# EAGLE design WheelPCB (EAGLE 9.6.2)
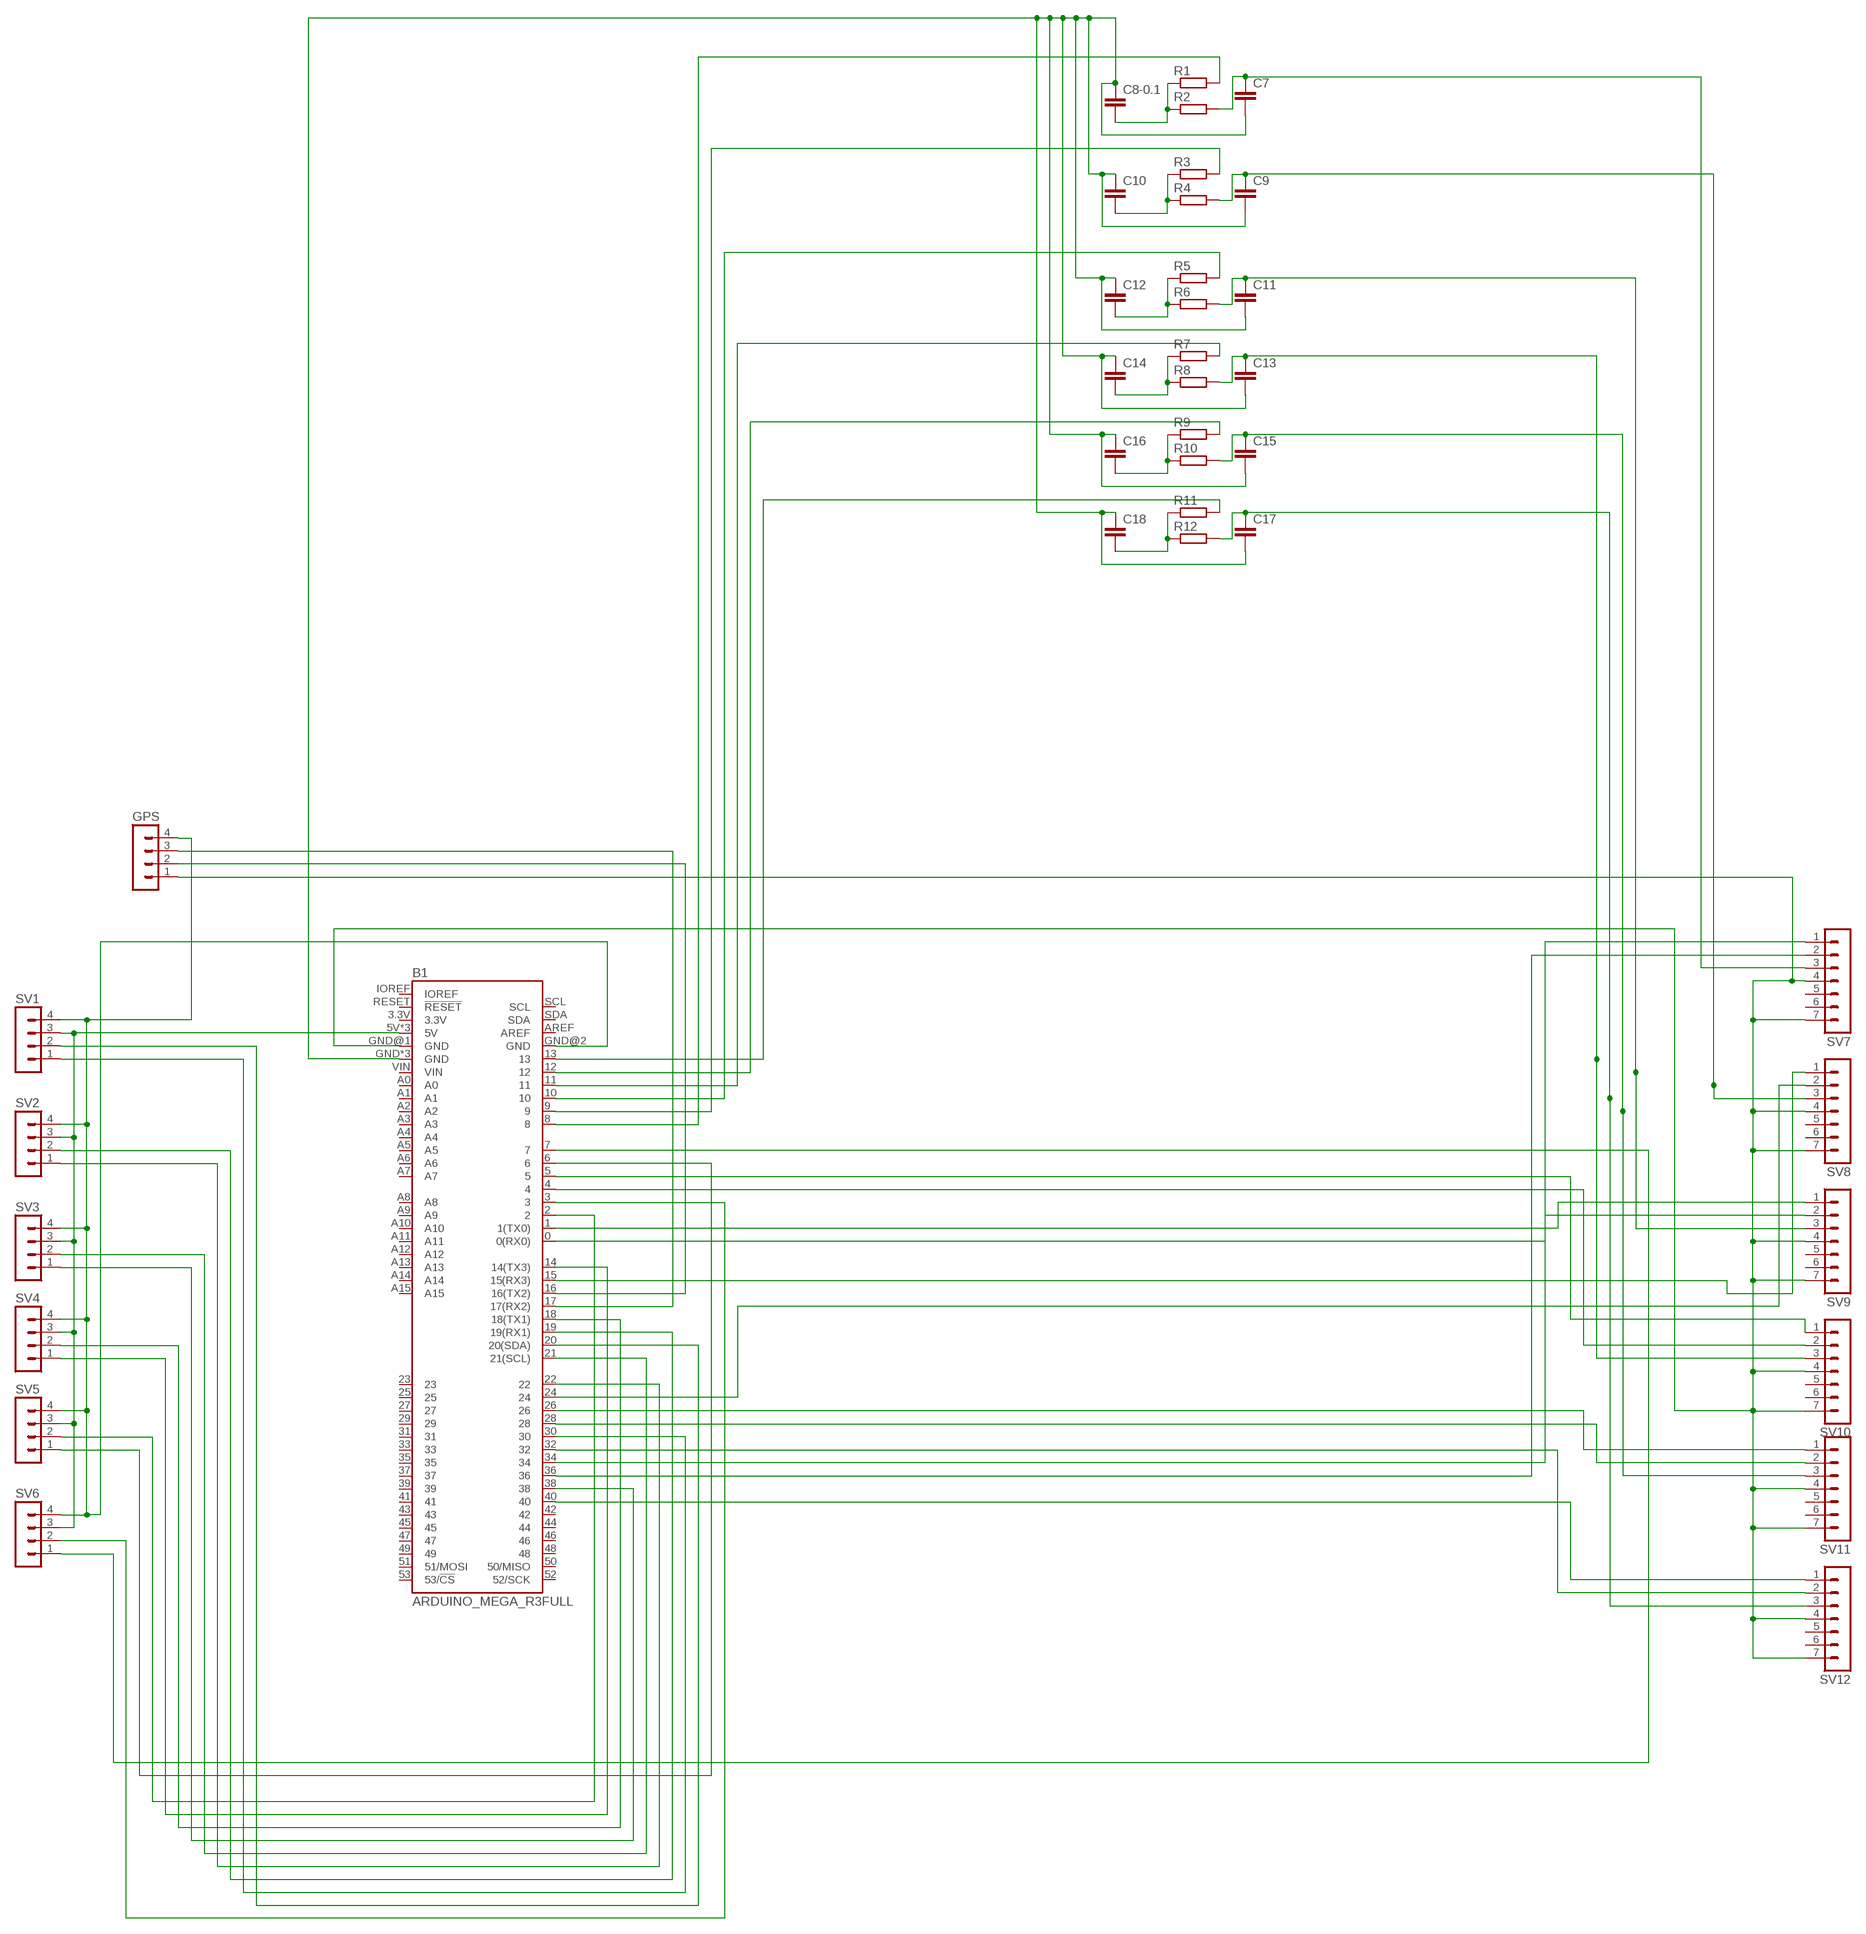
[diagram p0: schematic, sheet 1]

## Parts
B1  ARDUINO_MEGA_R3FULL  [ARDUINO_MEGA_NO_SILK]
C7  C2.5/5  [C2.5-5]
C8-0.1  C2.5/5  [C2.5-5]
C9  C2.5/5  [C2.5-5]
C10  C2.5/5  [C2.5-5]
C11  C2.5/5  [C2.5-5]
C12  C2.5/5  [C2.5-5]
C13  C2.5/5  [C2.5-5]
C14  C2.5/5  [C2.5-5]
C15  C2.5/5  [C2.5-5]
C16  C2.5/5  [C2.5-5]
C17  C2.5/5  [C2.5-5]
C18  C2.5/5  [C2.5-5]
GPS  MA04-1  [MA04-1]
R1  R-EU_0207/10  [0207/10]
R2  R-EU_0207/10  [0207/10]
R3  R-EU_0207/10  [0207/10]
R4  R-EU_0207/10  [0207/10]
R5  R-EU_0207/10  [0207/10]
R6  R-EU_0207/10  [0207/10]
R7  R-EU_0207/10  [0207/10]
R8  R-EU_0207/10  [0207/10]
R9  R-EU_0207/10  [0207/10]
R10  R-EU_0207/10  [0207/10]
R11  R-EU_0207/10  [0207/10]
R12  R-EU_0207/10  [0207/10]
SV1  MA04-1  [MA04-1]
SV2  MA04-1  [MA04-1]
SV3  MA04-1  [MA04-1]
SV4  MA04-1  [MA04-1]
SV5  MA04-1  [MA04-1]
SV6  MA04-1  [MA04-1]
SV7  MA07-1  [MA07-1]
SV8  MA07-1  [MA07-1]
SV9  MA07-1  [MA07-1]
SV10  MA07-1  [MA07-1]
SV11  MA07-1  [MA07-1]
SV12  MA07-1  [MA07-1]

## Nets
N$1: B1.GND@1(GND) GPS.1 SV7.4 SV7.7 SV8.4 SV8.7 SV9.4 SV9.7 SV10.4 SV10.7 SV11.4 SV11.7 SV12.4 SV12.7
N$2: C13.1 R8.2 SV10.3
N$3: B1.13 R11.2
N$4: C15.1 R10.2 SV11.3
N$5: C11.1 R6.2 SV9.3
N$6: C9.1 R4.2 SV8.3
N$7: C17.1 R12.2 SV12.3
N$8: B1.4 SV10.2
N$9: B1.5 SV10.1
N$10: B1.7 SV6.1
N$11: B1.6 SV5.1
N$12: B1.3 SV6.2
N$13: B1.2 SV5.2
N$14: B1.1(1(TX0)) SV9.1
N$15: B1.0(0(RX0)) SV9.2
N$16: B1.15(15(RX3)) SV8.1
N$17: B1.24 SV8.2
N$18: B1.40 SV12.1
N$19: B1.32 SV12.2
N$20: B1.26 SV11.1
N$21: B1.28 SV11.2
N$22: B1.34 SV7.1
N$23: B1.36 SV7.2
N$24: B1.14(14(TX3)) SV4.1
N$25: B1.18(18(TX1)) SV4.2
N$26: B1.38 SV3.1
N$27: B1.21(21(SCL)) SV3.2
N$28: B1.22 SV2.1
N$29: B1.19(19(RX1)) SV2.2
N$30: B1.30 SV1.1
N$31: B1.20(20(SDA)) SV1.2
N$32: B1.5V B1.5V@1(5V) B1.5V@2(5V) SV1.3 SV2.3 SV3.3 SV4.3 SV5.3 SV6.3
N$33: B1.GND@2(GND) GPS.4 SV1.4 SV2.4 SV3.4 SV4.4 SV5.4 SV6.4
N$34: B1.16(16(TX2)) GPS.2
N$35: B1.17(17(RX2)) GPS.3
N$36: B1.8 R1.2
N$37: C8-0.1.2 R1.1 R2.1
N$38: B1.10 R5.2
N$39: C7.1 R2.2 SV7.3
N$40: C10.2 R3.1 R4.1
N$42: B1.9 R3.2
N$43: C12.2 R5.1 R6.1
N$45: C14.2 R7.1 R8.1
N$46: B1.11 R7.2
N$47: C18.2 R11.1 R12.1
N$50: B1.12 R9.2
N$52: C16.2 R9.1 R10.1
N$53: B1.GND B1.GND@3(GND) B1.GND@4(GND) C7.2 C8-0.1.1 C9.2 C10.1 C11.2 C12.1 C13.2 C14.1 C15.2 C16.1 C17.2 C18.1
Unconnected: B1.3.3V B1.23 B1.25 B1.27 B1.29 B1.31 B1.33 B1.35 B1.37 B1.39 B1.41 B1.42 B1.43 B1.44 B1.45 B1.46 B1.47 B1.48 B1.49 B1.50(50/MISO) B1.51(51/MOSI) B1.52(52/SCK) B1.53(53/!CS) B1.A0 B1.A1 B1.A2 B1.A3 B1.A4 B1.A5 B1.A6 B1.A7 B1.A8 B1.A9 B1.A10 B1.A11 B1.A12 B1.A13 B1.A14 B1.A15 B1.AREF B1.IOREF B1.RESET(!RESET) B1.SCL B1.SDA B1.VIN SV7.5 SV7.6 SV8.5 SV8.6 SV9.5 SV9.6 SV10.5 SV10.6 SV11.5 SV11.6 SV12.5 SV12.6

## Library data of the parts
B1 = SparkFun-Boards:ARDUINO_MEGA_R3: Arduino Mega R3 ATmega2560 R3 compatible footprint. SparkFun Products: Arduino Mega 2560 R3 <https://www.sparkfun.com/products/11061>
C7 C8-0.1 C9-C18 = capacitor-wima:C: CAPACITOR naming: grid - package width
GPS SV1-SV6 = con-lstb:MA04-1: PIN HEADER; OC_FARNELL: unknown; OC_NEWARK: unknown
R1-R12 = rcl:R-EU_: RESISTOR, European symbol; SPICEPREFIX: R
SV7-SV12 = con-lstb:MA07-1: PIN HEADER; OC_FARNELL: unknown; OC_NEWARK: unknown

## Board
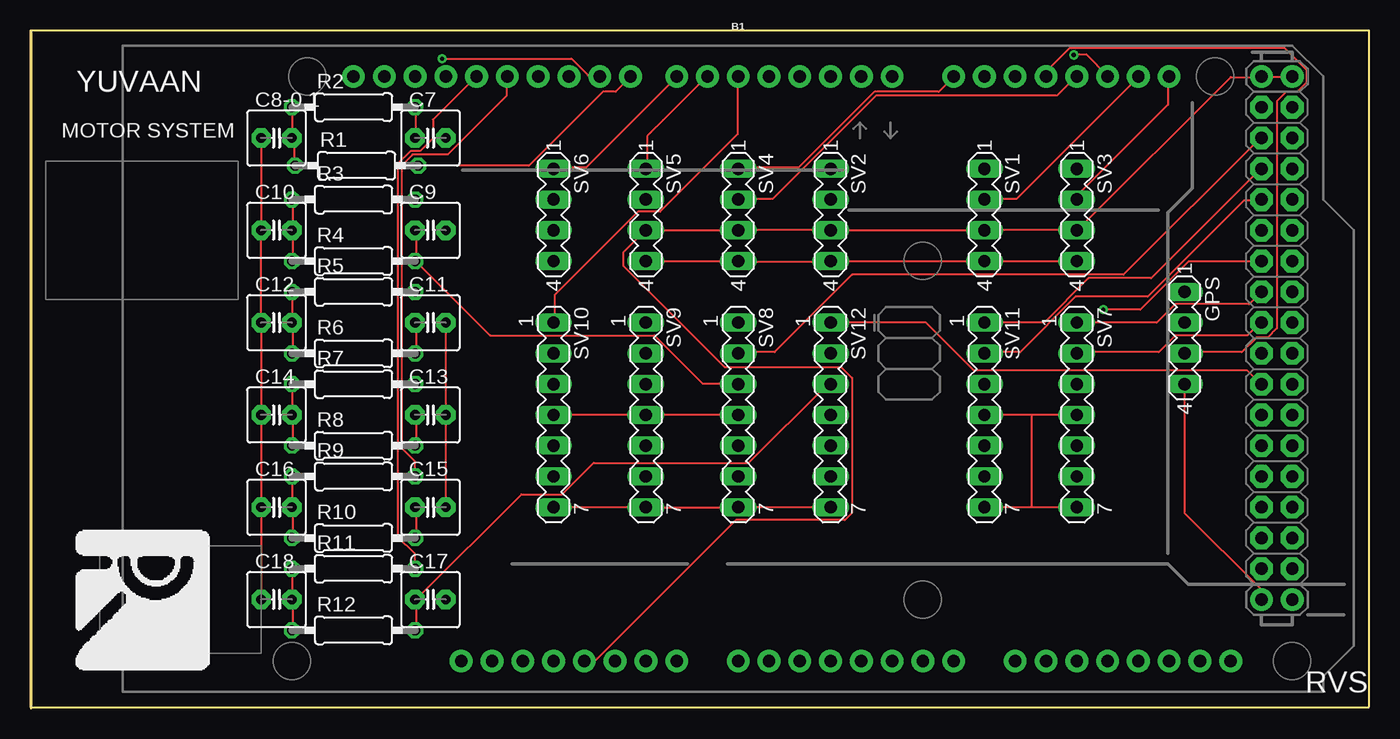
[diagram p1: board, top side]
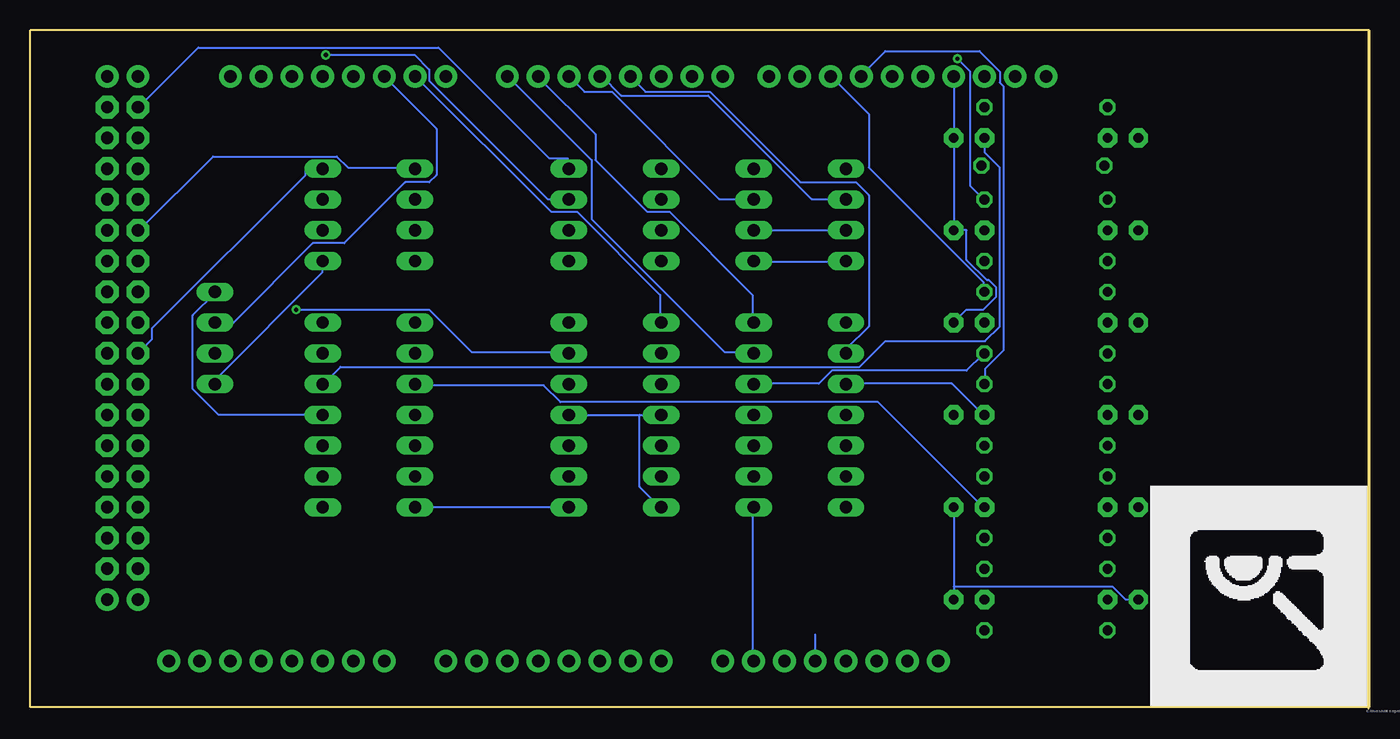
[diagram p2: board, bottom side, seen from below]

Size 110.49 x 55.98 mm. Coordinates in mm from the lower left corner, seen from the top.
Outline: 0.08,55.98 0,55.98 0,0.1 110.49,0.1 110.49,55.98 0.08,55.98
Outline: 0.08,55.98 0.08,0.03 0.05,0
Copper layers (1*16): Top 0.035mm / dielectric 1.5mm / Bottom 0.035mm
Design rules "default": minimum track width 6mil, minimum drill 0.35mm, track to track 6mil, track to pad 6mil, pad to pad 6mil, via to via 6mil, smd to smd 6mil, copper to edge 40mil, drill to drill 6mil, minimum pad ring 10mil, minimum via ring 8mil, stop-mask expansion 4mil, vias tented up to drill 0mil, thermal gap 10mil

### Footprints (pad centres in the part's own frame; a part is rotated, then mirrored left to right if it is on the bottom)
ARDUINO_MEGA_NO_SILK = drill 1.016 pad 1.88: 0 13.97,24.13; 1 11.43,24.13; 2 8.89,24.13; 3 6.35,24.13; 3.3V -13.97,-24.13; 4 3.81,24.13; 5 1.27,24.13; 5V -11.43,-24.13; 5V@1 44.45,24.13; 5V@2 46.99,24.13; 6 -1.27,24.13; 7 -3.81,24.13; 8 -7.62,24.13; 9 -10.16,24.13; 10 -12.7,24.13; 11 -15.24,24.13; 12 -17.78,24.13; 13 -20.32,24.13; 14 19.05,24.13; 15 21.59,24.13; 16 24.13,24.13; 17 26.67,24.13; 18 29.21,24.13; 19 31.75,24.13; 20 34.29,24.13; 21 36.83,24.13; A0 1.27,-24.13; A1 3.81,-24.13; A2 6.35,-24.13; A3 8.89,-24.13; A4 11.43,-24.13; A5 13.97,-24.13; A6 16.51,-24.13; A7 19.05,-24.13; A8 24.13,-24.13; A9 26.67,-24.13; A10 29.21,-24.13; A11 31.75,-24.13; A12 34.29,-24.13; A13 36.83,-24.13; A14 39.37,-24.13; A15 41.91,-24.13; AREF -25.4,24.13; GND -8.89,-24.13; GND@1 -6.35,-24.13; GND@2 44.45,-19.05; GND@3 46.99,-19.05; GND@4 -22.86,24.13; IOREF -19.05,-24.13; NC -21.59,-24.13; RESET -16.51,-24.13; SCL -30.48,24.13; SDA -27.94,24.13; VIN -3.81,-24.13 | drill 1.016 pad 1.88 octagon: 22 44.45,21.59; 23 46.99,21.59; 24 44.45,19.05; 25 46.99,19.05; 26 44.45,16.51; 27 46.99,16.51; 28 44.45,13.97; 29 46.99,13.97; 30 44.45,11.43; 31 46.99,11.43; 32 44.45,8.89; 33 46.99,8.89; 34 44.45,6.35; 35 46.99,6.35; 36 44.45,3.81; 37 46.99,3.81; 38 44.45,1.27; 39 46.99,1.27; 40 44.45,-1.27; 41 46.99,-1.27; 42 44.45,-3.81; 43 46.99,-3.81; 44 44.45,-6.35; 45 46.99,-6.35; 46 44.45,-8.89; 47 46.99,-8.89; 48 44.45,-11.43; 49 46.99,-11.43; 50 44.45,-13.97; 51 46.99,-13.97; 52 44.45,-16.51; 53 46.99,-16.51
C2.5-5 = drill 0.813 pad 1.6 octagon: 1 -1.27,0; 2 1.27,0
MA04-1 = drill 1.016 long: 1 -3.81,0; 2 -1.27,0; 3 1.27,0; 4 3.81,0
0207/10 = drill 0.813 octagon: 1 -5.08,0; 2 5.08,0
MA07-1 = drill 1.016 long: 1 -7.62,0; 2 -5.08,0; 3 -2.54,0; 4 0,0; 5 2.54,0; 6 5.08,0; 7 7.62,0

### Placement (x,y rotation side)
B1  57.15,28.04 0 top
C7  33.02,47.09 0 top
C8-0.1  20.32,47.09 0 top
C9  33.02,39.47 0 top
C10  20.32,39.47 0 top
C11  33.02,31.85 0 top
C12  20.32,31.85 0 top
C13  33.02,24.23 0 top
C14  20.32,24.23 0 top
C15  33.02,16.61 0 top
C16  20.32,16.61 0 top
C17  33.02,8.99 0 top
C18  20.32,8.99 0 top
GPS  95.25,30.58 270 top
R1  26.92,44.81 0 top
R2  26.67,49.63 0 top
R3  26.67,42.01 0 top
R4  26.67,36.93 0 top
R5  26.67,34.39 0 top
R6  26.67,29.31 0 top
R7  26.67,26.77 0 top
R8  26.67,21.69 0 top
R9  26.67,19.15 0 top
R10  26.67,14.07 0 top
R11  26.67,11.53 0 top
R12  26.67,6.45 0 top
SV1  78.74,40.74 270 top
SV2  66.04,40.74 270 top
SV3  86.36,40.74 270 top
SV4  58.42,40.74 270 top
SV5  50.8,40.74 270 top
SV6  43.18,40.74 270 top
SV7  86.36,24.23 270 top
SV8  58.42,24.23 270 top
SV9  50.8,24.23 270 top
SV10  43.18,24.23 270 top
SV11  78.74,24.23 270 top
SV12  66.04,24.23 270 top

### Tracks (layer width: path | path; a pad name or v marks a point on that pad's centre or on a via)
N$1
  Top 0.152: 50.9,3.96 B1.GND@1 | SV7.7 82.6,16.61 | 82.6,16.61 SV11.7 | SV7.4 82.6,24.23 | 82.6,24.23 SV11.4 | 82.6,24.23 82.6,16.61 | SV10.4 SV9.4 SV8.4 | SV12.7 SV8.7 SV9.7 SV10.7
  Bottom 0.152: SV7.4 94.95,24.23 97.08,26.37 97.08,32.46 95.25,34.29 GPS.1 | SV12.4 60.2,24.23 | 60.2,24.23 SV8.4 | B1.GND@1 50.9,3.96 50.9,16.61 SV9.7 | 60.2,24.23 60.2,18.29 58.52,16.61 SV8.7 | SV12.7 SV11.7
N$2
  Top 0.152: R8.2 31.85,21.79 31.85,24.23 C13.1
  Bottom 0.152: 42.52,26.82 43.13,26.82 SV10.3 42.52,26.82 | 42.52,26.82 34.44,26.82 31.85,24.23 C13.1
N$3
  Top 0.152: R11.2 31.7,11.58 31.7,12.8 30.33,14.17 30.33,44.96 31.39,46.02 32.16,46.02 33.22,47.09 33.22,48.62 36.73,52.12 B1.13
N$4
  Top 0.152: 78.64,26.67 SV11.3 | R10.2 31.85,14.17 31.85,16.61 C15.1
  Bottom 0.152: SV11.3 78.64,26.67 68.12,26.67 66.75,25.3 40.54,25.3 31.85,16.61 C15.1
N$5
  Top 0.152: R6.2 31.85,29.41 31.85,31.85 C11.1
  Bottom 0.152: SV9.3 50.75,26.82 45.42,26.82 44.35,27.89 33.22,27.89 31.85,29.26 R6.2
N$6
  Top 0.152: C9.1 31.85,39.47 31.85,37.03 R4.2 31.85,36.88 37.95,30.78 51.51,30.78 55.47,26.82 58.37,26.82 SV8.3
  Bottom 0.152: 58.37,26.82 SV8.3
N$7
  Top 0.152: 31.85,8.99 31.85,6.55 R12.2 | 31.85,8.99 40.54,17.68 43.89,17.68 46.48,20.27 59.28,20.27 65.68,26.67 65.99,26.67 SV12.3 | 31.85,8.99 C17.1
  Bottom 0.152: 65.99,26.82 SV12.3
N$8
  Bottom 0.152: 60.96,52.27 B1.4 60.96,52.12 59.74,50.9 54.41,50.9 46.94,43.43 42.37,43.43 41.3,42.37 41.3,31.55 43.13,29.72 43.13,29.41 SV10.2
N$9
  Top 0.152: SV10.1 43.28,31.85 43.28,34.14 50.14,41 51.97,41 58.37,47.4 58.37,52.12 B1.5
  Bottom 0.152: 43.28,31.85 SV10.1
N$10
  Top 0.152: SV6.1 43.28,44.65 45.87,44.65 53.34,52.12 B1.7
N$11
  Top 0.152: SV5.1 50.9,44.65 50.9,47.24 55.78,52.12 B1.6
N$12
  Top 0.152: 63.4,52.27 B1.3
  Bottom 0.152: SV6.2 43.28,42.06 46.02,42.06 54.56,50.6 61.72,50.6 63.4,52.27 B1.3
N$13
  Bottom 0.152: B1.2 64.77,50.9 62.48,50.9 53.64,42.06 50.9,42.06 SV5.2
N$14
  Bottom 0.152: SV9.1 50.9,31.85 50.9,34.14 57.76,41 59.59,41 63.86,45.26 63.86,47.4 68.58,52.12 B1.1
N$15
  Bottom 0.152: SV9.2 50.9,29.41 53.19,29.41 64.16,40.39 64.16,45.26 71.02,52.12 B1.0
N$16
  Bottom 0.152: SV8.1 58.52,31.85 58.52,34.14 65.38,41 67.51,41 78.64,52.12 B1.15
N$17
  Top 0.152: SV8.2 58.52,29.41 61.42,29.41 67.82,35.81 90.22,35.81 101.5,47.09 B1.24
  Bottom 0.152: 58.52,29.72 58.52,29.41 SV8.2
N$18
  Top 0.152: SV12.1 73.91,31.85 77.88,27.89 100.43,27.89 101.5,26.82 B1.40
N$19  (via drill 0.35)
  Top 0.152: 65.99,29.72 65.99,29.41 SV12.2 | v88.54,32.92 91.59,32.92 95.55,36.88 101.5,36.88 B1.32
  Bottom 0.152: v88.54,32.92 77.57,32.92 74.07,29.41 66.14,29.41 SV12.2
N$20
  Top 0.152: SV11.1 83.67,31.85 87.33,35.51 92.51,35.51 101.5,44.5 B1.26
  Bottom 0.152: 78.79,31.85 SV11.1
N$21
  Top 0.152: SV11.2 78.79,29.41 81.69,29.41 86.26,33.99 92.2,33.99 100.13,41.91 101.5,41.91 B1.28
  Bottom 0.152: 78.79,29.72 78.79,29.41 SV11.2 | 101.5,42.06 B1.28
N$22
  Top 0.152: SV7.1 92.96,31.85 94.49,33.38 100.58,33.38 B1.34
N$23
  Top 0.152: SV7.2 86.41,29.41 93.12,29.41 94.49,30.78 100.43,30.78 101.5,31.85 B1.36
N$24
  Top 0.152: SV4.1 58.52,44.65 63.4,44.65 69.65,50.9 74.98,50.9 76.2,52.12 B1.14
N$25
  Top 0.152: SV4.2 58.52,42.06 61.26,42.06 69.8,50.6 84.73,50.6 86.26,52.12 B1.18
N$26
  Bottom 0.152: 87.78,44.5 86.41,44.5 SV3.1 87.78,44.5 | 87.78,44.5 87.78,44.04 100.43,31.39 100.43,30.48 B1.38
N$27
  Top 0.152: SV3.2 86.41,42.06 86.41,42.37 93.88,49.83 93.88,52.12 B1.21
  Bottom 0.152: 86.41,41.91 SV3.2
N$28
  Bottom 0.152: SV2.1 66.14,44.65 66.14,45.42 67.67,45.42 76.81,54.56 96.62,54.56 101.5,49.68 B1.22
N$29  (via drill 0.35)
  Top 0.152: v86.11,53.95 87.17,53.95 88.85,52.27 B1.19
  Bottom 0.152: v86.11,53.95 78.79,53.95 77.57,52.73 77.57,51.82 67.82,42.06 66.14,42.06 SV2.2
N$30
  Top 0.152: 78.79,44.5 SV1.1
  Bottom 0.152: SV1.1 78.79,44.65 84.28,44.65 85.19,45.57 95.4,45.57 101.5,39.47 B1.30
N$31
  Top 0.152: SV1.2 78.79,42.06 81.38,42.06 91.44,52.12 B1.20
N$32
  Top 0.152: B1.5V@2 104.09,52.12 101.65,52.12 B1.5V@1 101.5,52.12 99.06,52.12 86.41,39.47 SV3.3 SV1.3 SV2.3 SV4.3 SV5.3 50.75,39.47 48.92,37.64 48.92,36.58 57.3,28.19 66.9,28.19 67.82,27.28 67.82,16.15 67.21,15.54 58.22,15.54 46.63,3.96 45.72,3.96 B1.5V
  Bottom 0.152: 101.65,52.12 B1.5V@1 | 78.79,39.47 SV1.3 | 45.72,6.1 B1.5V | 65.99,39.47 SV2.3 | SV5.3 SV6.3
N$33
  Top 0.152: 95.25,26.82 GPS.4 95.25,16.15 101.5,9.91 | 101.5,9.91 101.5,8.99 B1.GND@2 101.5,9.91 | SV5.4 50.9,36.88 58.37,36.88 SV4.4 58.52,36.88 65.99,36.88 SV2.4 66.14,36.88 78.64,36.88 SV1.4 78.79,36.88 86.26,36.88 SV3.4
  Bottom 0.152: 43.13,36.88 SV6.4 43.28,36.88 50.75,36.88 SV5.4 | 66.14,36.88 SV2.4 | 78.64,36.88 SV1.4 | GPS.4 95.25,27.13 86.41,35.97 86.41,36.88 SV3.4
N$34
  Bottom 0.152: GPS.2 93.73,31.85 87.17,38.4 84.58,38.4 79.55,43.43 77.57,43.43 76.96,44.04 76.96,47.85 B1.16
N$35
  Top 0.152: B1.17 83.82,52.58 85.8,54.56 103.48,54.56 105.31,52.73 105.31,51.66 104.55,50.9 103.63,50.9 102.87,50.14 102.87,31.39 102.11,30.63 101.19,30.63 99.97,29.41 95.25,29.41 GPS.3
N$36
  Top 0.152: R1.2 41.15,44.81 47.24,50.9 48.31,50.9 49.53,52.12 B1.8
  Bottom 0.152: 49.53,52.27 B1.8
N$37
  Top 0.152: 21.64,49.63 R2.1 21.64,49.53 21.64,47.09 | 21.79,44.91 R1.1 21.79,44.96 21.79,46.94 21.64,47.09 | 21.64,47.09 C8-0.1.2
N$38
  Bottom 0.152: R5.2 31.85,34.44 31.85,35.2 41.3,44.65 41.3,49.07 44.35,52.12 B1.10
N$39
  Top 0.152: 86.26,26.67 SV7.3 | 31.85,47.09 31.85,47.19 C7.1 31.85,47.24 31.85,49.53 R2.2 31.85,49.63
  Bottom 0.152: C7.1 31.7,47.09 31.7,45.87 30.48,44.65 30.48,31.55 31.7,30.33 39.93,30.33 42.06,28.19 84.89,28.19 86.26,26.82 SV7.3
N$40
  Top 0.152: 21.64,39.47 21.64,37.03 R4.1 | 21.64,39.47 21.64,41.91 R3.1 | 21.64,39.47 C10.2
N$42  (via drill 0.35)
  Top 0.152: 31.7,42.06 R3.2 | v33.99,53.64 44.65,53.64 46.02,52.27 46.94,52.27 B1.9
  Bottom 0.152: 47.09,52.12 B1.9 | v33.99,53.64 32.92,52.58 32.92,43.13 31.85,42.06 R3.2
N$43
  Top 0.152: 21.64,31.85 21.64,29.41 R6.1 | 21.64,31.85 21.64,34.29 R5.1 | 21.64,31.85 C12.2
N$45
  Top 0.152: 21.64,24.23 21.64,21.79 R8.1 | 21.64,24.23 21.64,26.67 R7.1 | 21.64,24.23 C14.2
N$46
  Bottom 0.152: R7.2 31.7,26.82 31.7,28.04 30.18,29.57 30.18,51.36 30.48,51.66 30.48,52.58 32.16,54.25 39.93,54.25 41.91,52.27 B1.11
N$47
  Top 0.152: 21.64,8.99 21.64,6.55 R12.1 | 21.64,8.99 21.64,11.43 R11.1 | 21.64,8.99 C18.2
N$50
  Top 0.152: R9.2 31.7,19.2 31.7,20.42 30.63,21.49 30.63,44.81 31.55,45.72 34.44,45.72 39.32,50.6 39.32,52.12 B1.12
N$52
  Top 0.152: 21.64,16.61 21.64,14.17 R10.1 | 21.64,16.61 21.64,19.05 R9.1 | 21.64,16.61 C16.2
N$53
  Top 0.152: C8-0.1.1 C10.1 C12.1 C14.1 C16.1 C18.1 | C11.2 C13.2 C15.2
  Bottom 0.152: B1.GND@4 C7.2 C9.2 33.22,39.47 33.22,37.03 31.55,35.36 31.39,35.36 30.78,34.75 30.78,33.99 31.85,32.92 33.22,32.92 C11.2 | C15.2 34.29,10.06 | 34.29,10.06 C17.2 | C18.1 20.12,8.99 21.18,10.06 34.29,10.06

### Text on the board
tPlace: YUVAAN | MOTOR SYSTEM | RVS
bPlace: C:/Users/rohit sagvekar/OneDrive - Indian Institute of Technology Guwahati/Pictures/image final (2).bmp